# Altium schematic sheet EST_MainV20_Voice.SchDoc
size A4
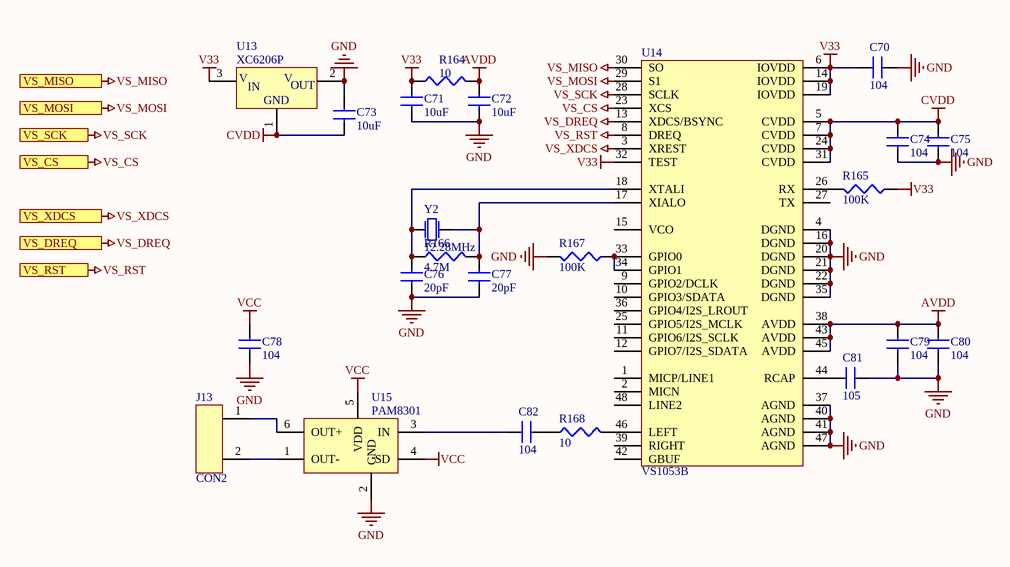
[diagram p0: EST_MainV20_Voice.SchDoc]

## Parts
C70  104  [CAP_0603]
C71  10uF  [CAP_0805]
C72  10uF  [CAP_0805]
C73  10uF  [CAP_0805]
C74  104  [CAP_0603]
C75  104  [CAP_0603]
C76  20pF  [CAP_0603]
C77  20pF  [CAP_0603]
C78  104  [CAP_0603]
C79  104  [CAP_0603]
C80  104  [CAP_0603]
C81  105  [CAP_0603]
C82  104  [CAP_0603]
J13  CON2  [SIP2]
R164  10  [0805]
R165  100K  [RES_0603]
R166  4.7M  [RES_0603]
R167  100K  [RES_0603]
R168  10  [RES_0603]
U13  XC6206P  [8050SMD]
U14  VS1053B  [LQFP48]
U15  PAM8301  [SOT23-6New]
Y2  12.28MHz  [XTAL_5032]

## Ports
VS_CS, VS_DREQ, VS_MISO, VS_MOSI, VS_RST, VS_SCK, VS_XDCS

## Nets
AVDD: C72.2 C79.2 C80.2 R164.1(TOP) U14.38(AVDD) U14.43(AVDD) U14.45(AVDD)
CVDD: C73.1 C74.2 C75.2 U13.1(GND) U14.5(CVDD) U14.7(CVDD) U14.24(CVDD) U14.31(CVDD)
GND: C70.2 C71.1 C72.1 C73.2 C74.1 C75.1 C76.1 C77.1 C78.1 C79.1 C80.1 C81.1 R167.2(BOT) U13.2(VOUT) U14.4(DGND) U14.16(DGND) U14.20(DGND) U14.21(DGND) U14.22(DGND) U14.35(DGND) U14.37(AGND) U14.40(AGND) U14.41(AGND) U14.47(AGND) U15.2(GND)
V33: C70.1 C71.2 R164.2(BOT) R165.1(TOP) U13.3(VIN) U14.6(IOVDD) U14.14(IOVDD) U14.19(IOVDD) U14.32(TEST)
VCC: C78.2 U15.4(SD) U15.5(VDD)
VS_CS: U14.23(XCS) ; port VS_CS
VS_DREQ: U14.13(XDCS/BSYNC) ; port VS_DREQ
VS_MISO: U14.30(SO) ; port VS_MISO
VS_MOSI: U14.29(S1) ; port VS_MOSI
VS_RST: U14.8(DREQ) ; port VS_RST
VS_SCK: U14.28(SCLK) ; port VS_SCK
VS_XDCS: U14.3(XREST) ; port VS_XDCS
NetC76_2: C76.2 R166.1(TOP) U14.18(XTALI) Y2.2(P2)
NetC77_2: C77.2 R166.2(BOT) U14.17(XIALO) Y2.1(P1)
NetC81_2: C81.2 U14.44(RCAP)
NetC82_1: C82.1 U15.3(IN)
NetC82_2: C82.2 R168.2(BOT)
NetJ13_1: J13.1 U15.6(OUT+)
NetJ13_2: J13.2 U15.1(OUT-)
NetR165_2: R165.2(BOT) U14.26(RX)
NetR167_1: R167.1(TOP) U14.33(GPIO0) U14.34(GPIO1)
NetR168_1: R168.1(TOP) U14.46(LEFT)

Not connected (* = marked no-connect by the designer): U14 1(MICP/LINE1) 2(MICN) 9(GPIO2/DCLK) 10(GPIO3/SDATA) 11(GPIO6/I2S_SCLK) 12(GPIO7/I2S_SDATA) 15(VCO) 25(GPIO5/I2S_MCLK) 27(TX) 36(GPIO4/I2S_LROUT) 39(RIGHT) 42(GBUF) 48(LINE2)

## Notes on the sheet
- (in symbol XC6206P) V; IN; OUT

## Library data of the parts
C70-C75 C79-C81 = CAP: Capacitor; Value: 20pF
C76-C78 C82 = CAP: Capacitor
  C76 C77: Value: 20pF
J13 = CON2: SOCKET
R164-R168 = RES: Resistor
U14 = VS1053
Y2 = XTAL: CRYSTAL